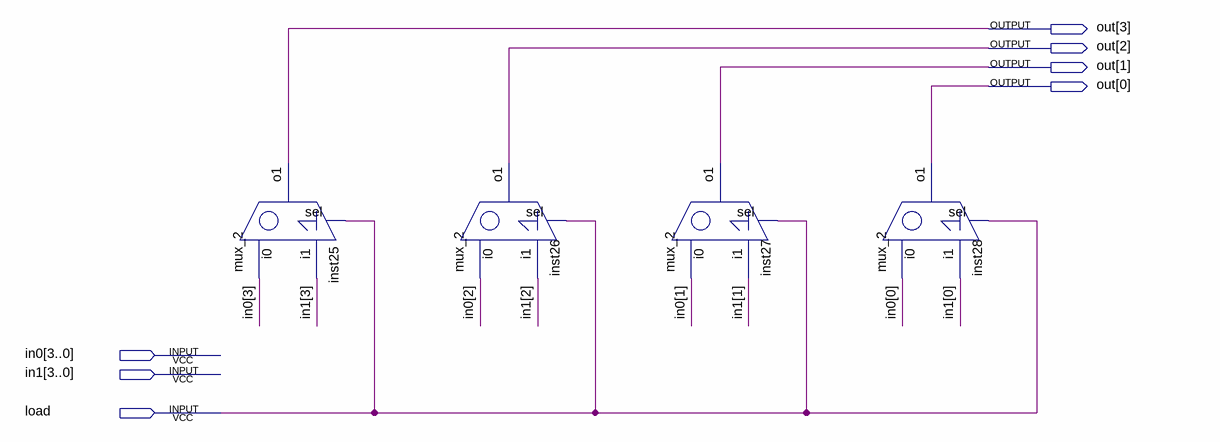
[diagram p0: schematic sheet]
// Quartus schematic mux4.bdf as structural Verilog: 4 symbols, 7 pins
module mux4 (
  input  [3:0] in0,
  input  [3:0] in1,
  input  load,
  output [3:0] out
);

  mux_2 inst25 (.sel(load), .i0(in0[3]), .i1(in1[3]), .o1(out[3]));
  mux_2 inst26 (.sel(load), .i0(in0[2]), .i1(in1[2]), .o1(out[2]));
  mux_2 inst27 (.sel(load), .i0(in0[1]), .i1(in1[1]), .o1(out[1]));
  mux_2 inst28 (.sel(load), .i0(in0[0]), .i1(in1[0]), .o1(out[0]));
endmodule
